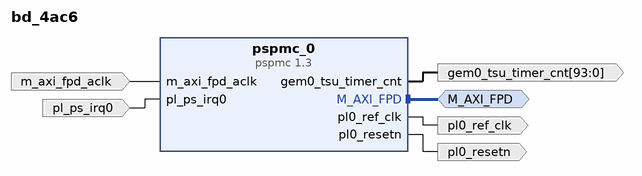
[diagram p0: block diagram of the top level]
# Vivado block design bd_4ac6, xcvm1802-vsva2197-2MP-e-S, Vivado 2022.2
create_bd_design bd_4ac6

create_bd_intf_port -mode Master -vlnv xilinx.com:interface:aximm_rtl:1.0 M_AXI_FPD
create_bd_port -dir O -type clk pl0_ref_clk
set_property -dict {CONFIG.FREQ_HZ 99999901} [get_bd_ports pl0_ref_clk]
create_bd_port -dir O -type rst pl0_resetn
create_bd_port -dir I -type clk m_axi_fpd_aclk
create_bd_port -dir O -from 93 -to 0 gem0_tsu_timer_cnt
create_bd_port -dir I -type intr pl_ps_irq0

create_bd_cell -type ip -vlnv xilinx.com:ip:pspmc:1.3 pspmc_0
